# EasyEDA schematic 7 SEGMENT PCB.json
TITLE: Sheet_1; REV: 1.0; Date: 2024-04-04; Sheet: 1/1; Drawn By: ab2397; Company: Your Company
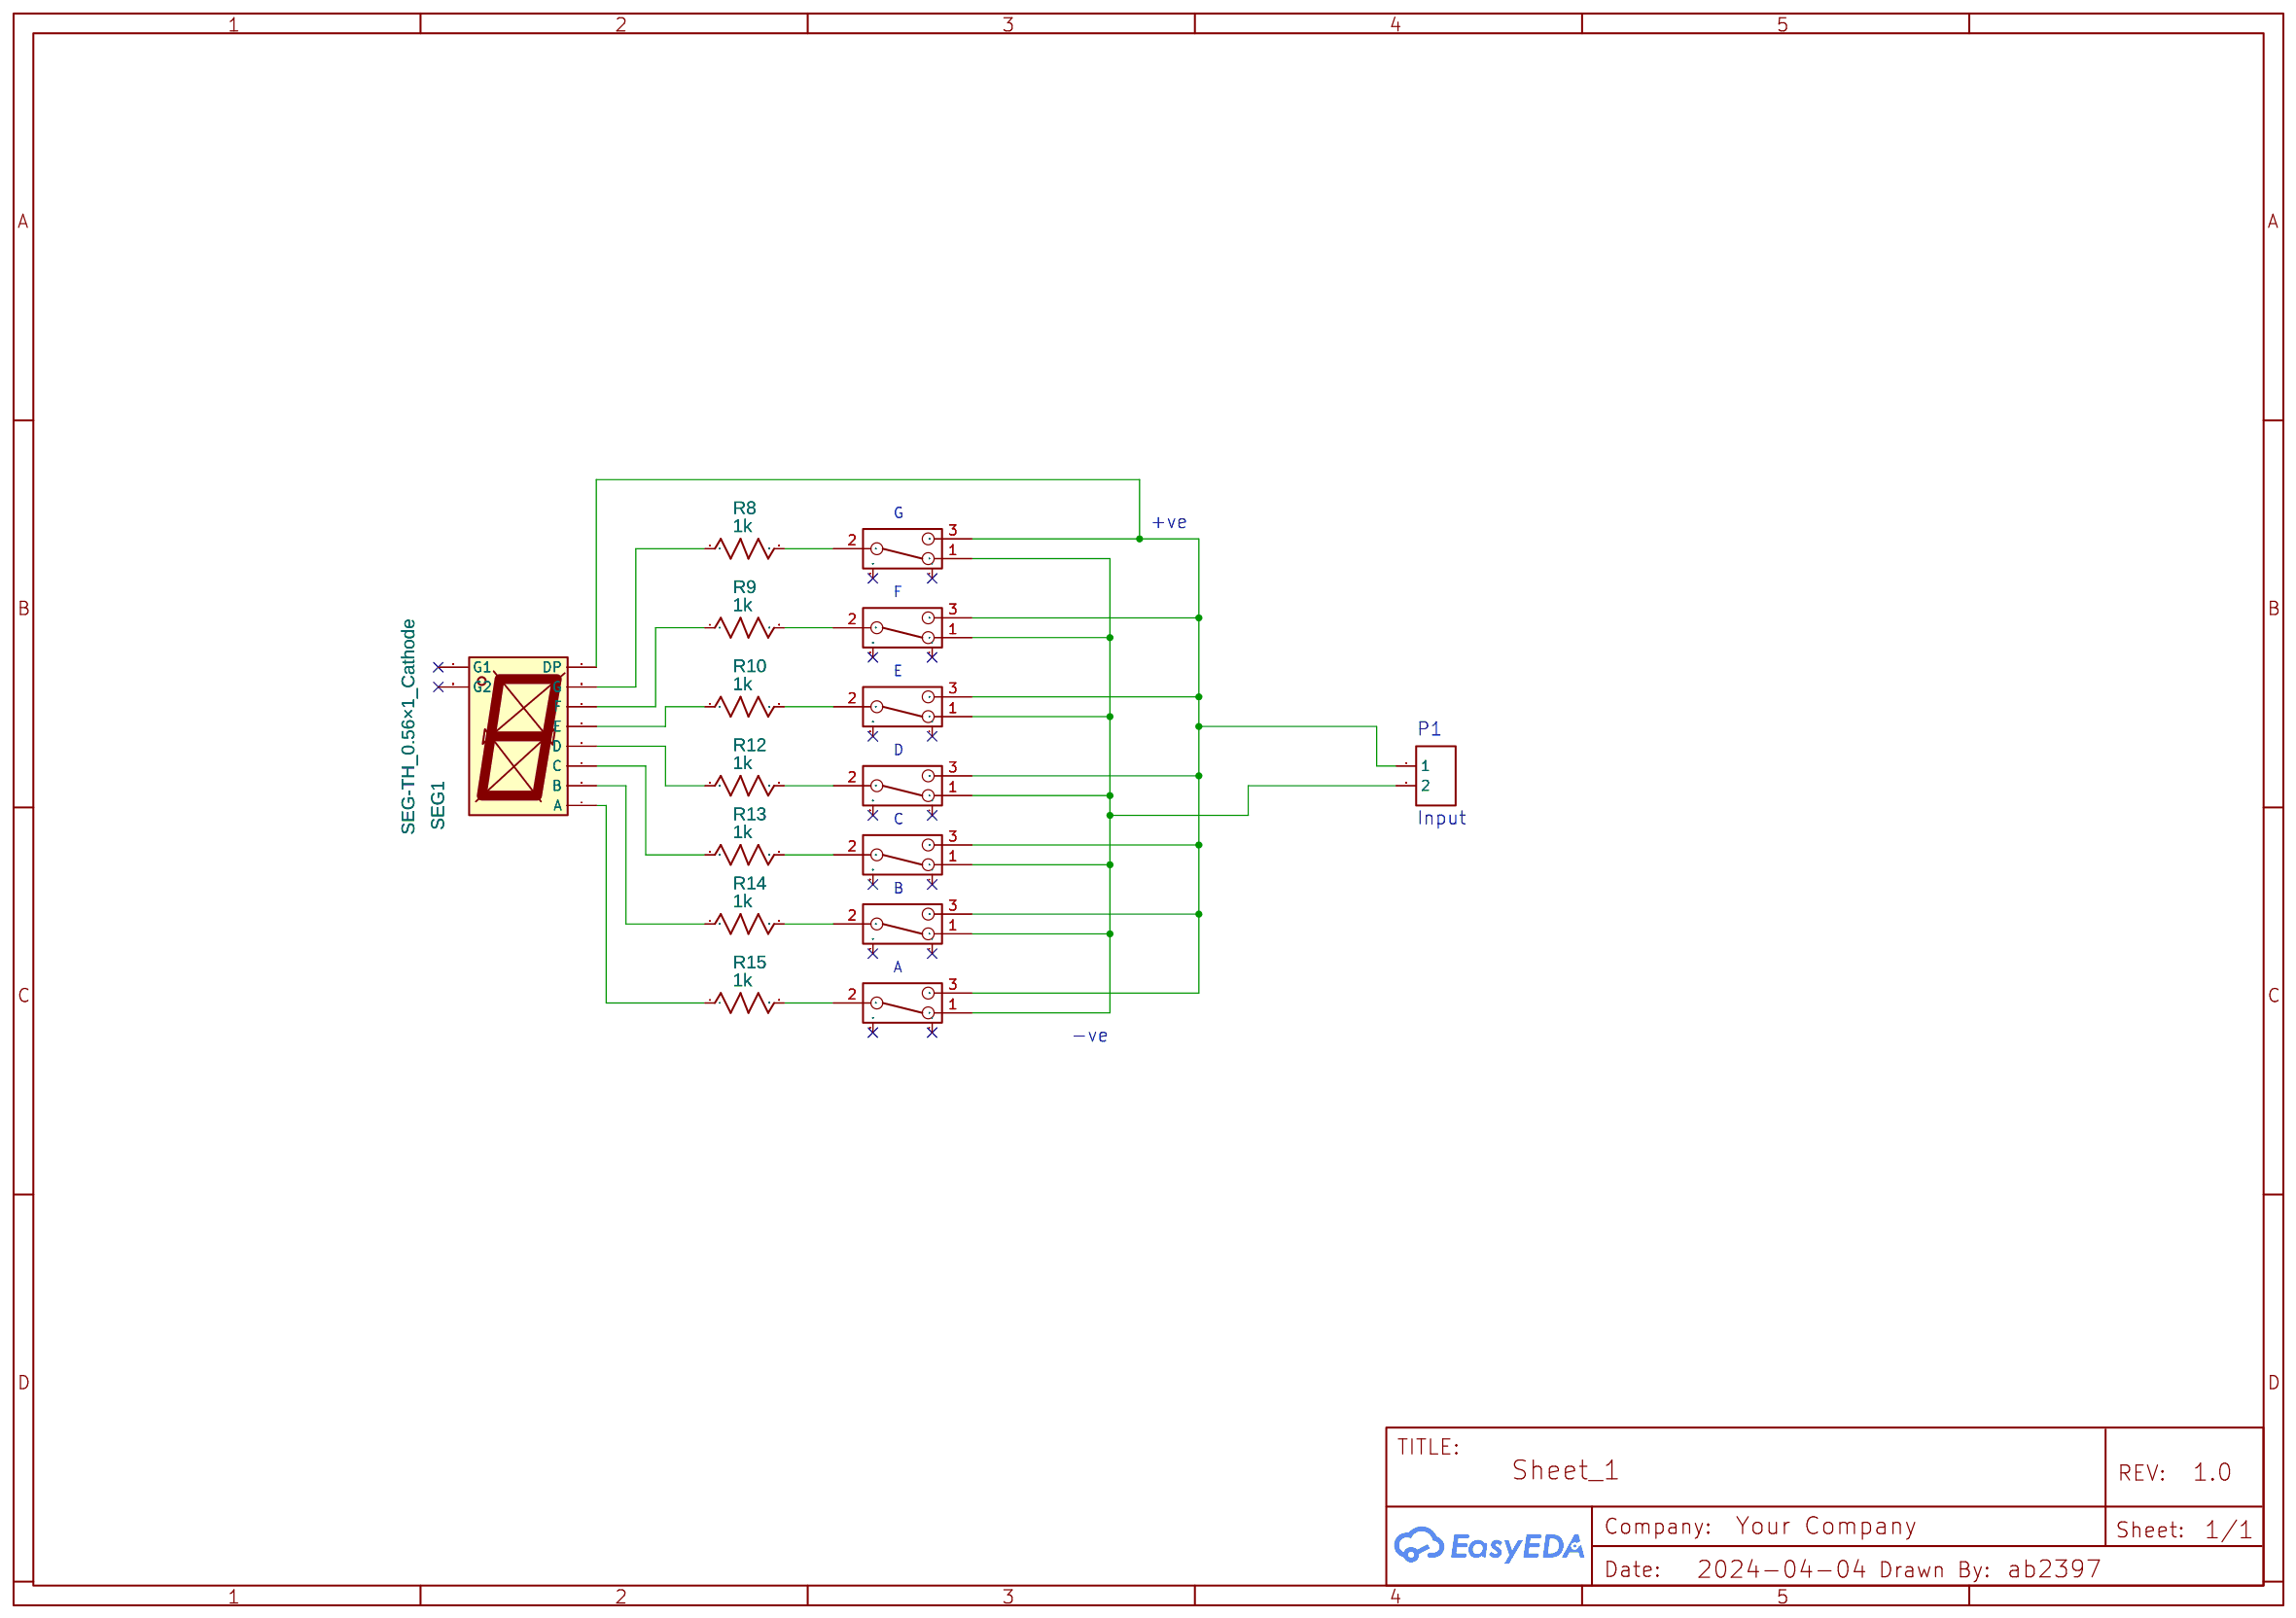
[diagram p0: schematic sheet]

## Parts
H1  HDR-F-2.54_1x2  [HDR-F-2.54_1X2]
R8  1k  [R0603]
R9  1k  [R0603]
R10  1k  [R0603]
R12  1k  [R0603]
R13  1k  [R0603]
R14  1k  [R0603]
R15  1k  [R0603]
SEG1  SEG-TH_0.56×1_Cathode  [LED-SEG-TH_10P-L12.6-W19.0-P2.54-S15.24-BL]
SW1  SK-12D02-VG5  [SW-TH_SK-12D02VG3]
SW2  SK-12D02-VG5  [SW-TH_SK-12D02VG3]
SW3  SK-12D02-VG5  [SW-TH_SK-12D02VG3]
SW4  SK-12D02-VG5  [SW-TH_SK-12D02VG3]
SW5  SK-12D02-VG5  [SW-TH_SK-12D02VG3]
SW6  SK-12D02-VG5  [SW-TH_SK-12D02VG3]
SW7  SK-12D02-VG5  [SW-TH_SK-12D02VG3]

## Library data of the parts
H1 = HDR-F-2.54_1x2: Supplier Part: C49661; Supplier: LCSC; Contributor: LCEDA_Lib
R8-R10 R12-R15 = R_0603_US: Contributor: LCEDA_Lib
SEG1 = SEG-TH_0.56×1_Cathode: Manufacturer: 志浩; Supplier Part: C8093; Contributor: LCEDA_01
SW1-SW7 = SK-12D02-VG5: Supplier: LCSC; Supplier Part: C136722; Manufacturer: Rectangular Connectors - Contacts; Contributor: LCSC

## Nets
Net-(H1-1): H1.1 SEG1.5(DP) SW1.3 SW2.3 SW3.3 SW4.3 SW5.3 SW6.3 SW7.3
Net-(H1-2): H1.2 SW1.1 SW2.1 SW3.1 SW4.1 SW5.1 SW6.1 SW7.1
Net-(R8-1): R8.1 SEG1.10(G)
Net-(R8-2): R8.2 SW1.2
Net-(R9-1): R9.1 SEG1.9(F)
Net-(R9-2): R9.2 SW2.2
Net-(R10-1): R10.1 SEG1.1(E)
Net-(R10-2): R10.2 SW3.2
Net-(R12-1): R12.1 SEG1.2(D)
Net-(R12-2): R12.2 SW4.2
Net-(R13-1): R13.1 SEG1.4(C)
Net-(R13-2): R13.2 SW5.2
Net-(R14-1): R14.1 SEG1.6(B)
Net-(R14-2): R14.2 SW6.2
Net-(R15-1): R15.1 SEG1.7(A)
Net-(R15-2): R15.2 SW7.2

Not connected (* = marked no-connect by the designer): SEG1 3(G1)* 8(G2)*; SW1 4* 5*; SW2 4* 5*; SW3 4* 5*; SW4 4* 5*; SW5 4* 5*; SW6 4* 5*; SW7 4* 5*

## Notes on the sheet
- G
- +ve
- F
- E
- P1
- D
- C
- Input
- B
- A
- -ve
